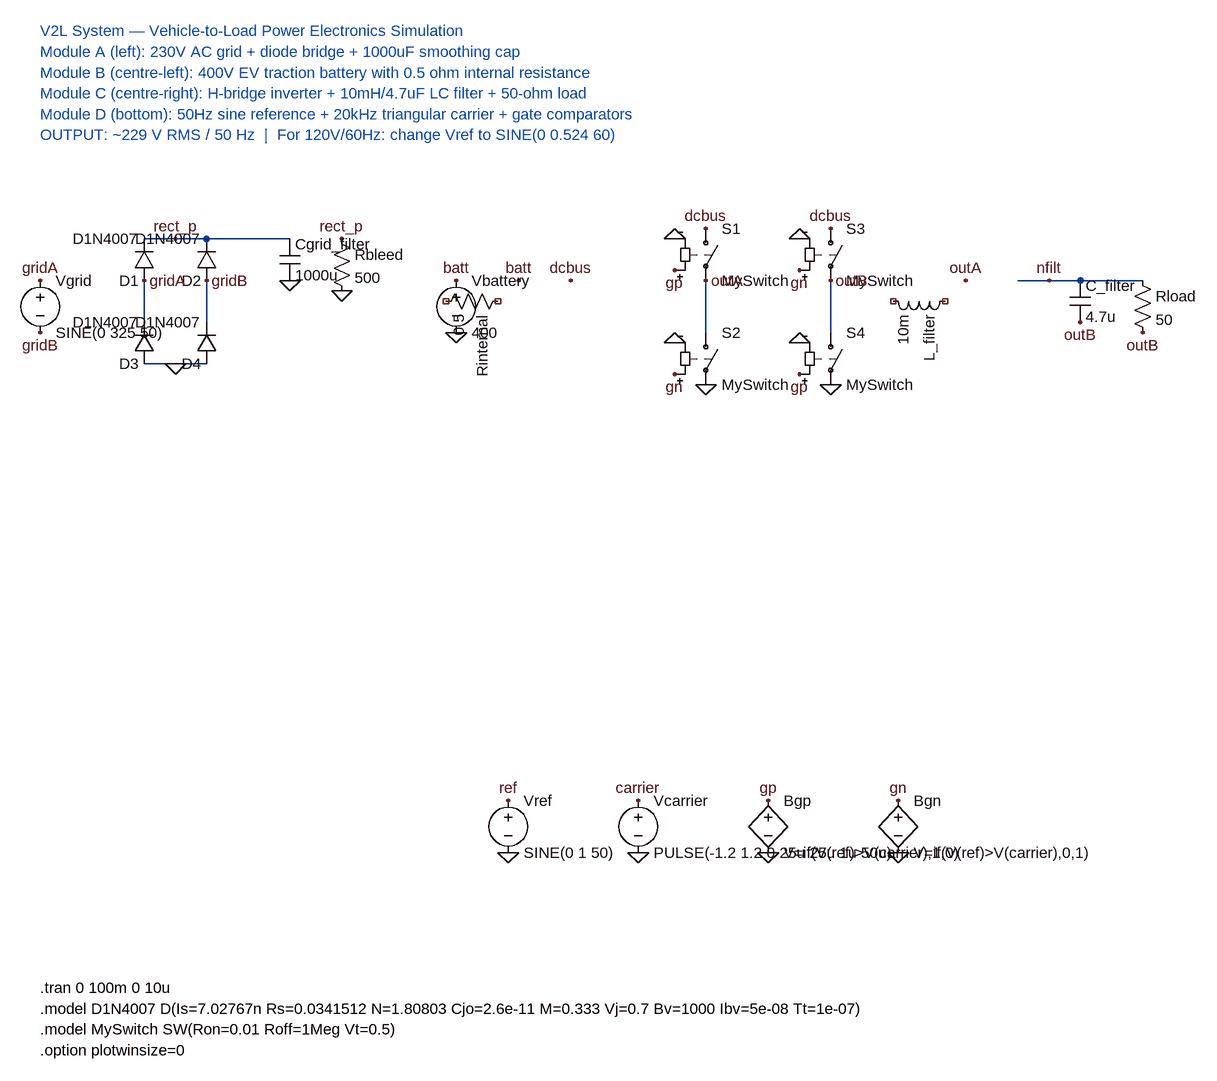
[diagram p0: schematic v2l.asc]
v2l.asc, the LTspice schematic file:
Version 4
SHEET 1 3600 2400
WIRE 240 368 336 368
WIRE 336 368 464 368
WIRE 240 560 336 560
WIRE 240 432 240 496
WIRE 336 432 336 496
WIRE 1104 432 1104 512
WIRE 1296 432 1296 512
WIRE 1584 432 1680 432
WIRE 1680 432 1776 432
FLAG 80 432 gridA
FLAG 80 512 gridB
FLAG 288 368 rect_p
FLAG 240 432 gridA
FLAG 336 432 gridB
FLAG 288 560 0
FLAG 464 432 0
FLAG 544 368 rect_p
FLAG 544 448 0
FLAG 720 432 batt
FLAG 720 512 0
FLAG 816 432 batt
FLAG 896 432 dcbus
FLAG 1104 352 dcbus
FLAG 1104 432 outA
FLAG 1056 416 gp
FLAG 1056 368 0
FLAG 1104 592 0
FLAG 1056 576 gn
FLAG 1056 528 0
FLAG 1296 352 dcbus
FLAG 1296 432 outB
FLAG 1248 416 gn
FLAG 1248 368 0
FLAG 1296 592 0
FLAG 1248 576 gp
FLAG 1248 528 0
FLAG 1504 432 outA
FLAG 1632 432 nfilt
FLAG 1680 496 outB
FLAG 1776 512 outB
FLAG 800 1232 ref
FLAG 800 1312 0
FLAG 1000 1232 carrier
FLAG 1000 1312 0
FLAG 1200 1232 gp
FLAG 1200 1312 0
FLAG 1400 1232 gn
FLAG 1400 1312 0
SYMBOL Voltage 80 416 R0
SYMATTR InstName Vgrid
SYMATTR Value SINE(0 325 50)
SYMBOL Diode 256 432 R180
SYMATTR InstName D1
SYMATTR Value D1N4007
SYMBOL Diode 352 432 R180
SYMATTR InstName D2
SYMATTR Value D1N4007
SYMBOL Diode 256 560 R180
SYMATTR InstName D3
SYMATTR Value D1N4007
SYMBOL Diode 352 560 R180
SYMATTR InstName D4
SYMATTR Value D1N4007
SYMBOL Cap 448 368 R0
SYMATTR InstName Cgrid_filter
SYMATTR Value 1000u
SYMBOL Res 528 352 R0
SYMATTR InstName Rbleed
SYMATTR Value 500
SYMBOL Voltage 720 416 R0
SYMATTR InstName Vbattery
SYMATTR Value 400
SYMBOL Res 800 448 R90
SYMATTR InstName Rinternal
SYMATTR Value 0.5
SYMBOL Sw 1104 336 R0
SYMATTR InstName S1
SYMATTR Value MySwitch
SYMBOL Sw 1104 496 R0
SYMATTR InstName S2
SYMATTR Value MySwitch
SYMBOL Sw 1296 336 R0
SYMATTR InstName S3
SYMATTR Value MySwitch
SYMBOL Sw 1296 496 R0
SYMATTR InstName S4
SYMATTR Value MySwitch
SYMBOL Ind 1488 448 R90
SYMATTR InstName L_filter
SYMATTR Value 10m
SYMBOL Cap 1664 432 R0
SYMATTR InstName C_filter
SYMATTR Value 4.7u
SYMBOL Res 1760 416 R0
SYMATTR InstName Rload
SYMATTR Value 50
SYMBOL Voltage 800 1216 R0
SYMATTR InstName Vref
SYMATTR Value SINE(0 1 50)
SYMBOL Voltage 1000 1216 R0
SYMATTR InstName Vcarrier
SYMATTR Value PULSE(-1.2 1.2 0 25u 25u 1u 50u)
SYMBOL Bv 1200 1216 R0
SYMATTR InstName Bgp
SYMATTR Value V=if(V(ref)>V(carrier),1,0)
SYMBOL Bv 1400 1216 R0
SYMATTR InstName Bgn
SYMATTR Value V=if(V(ref)>V(carrier),0,1)
TEXT 80 48 Left 2 ;V2L System — Vehicle-to-Load Power Electronics Simulation
TEXT 80 80 Left 2 ;Module A (left): 230V AC grid + diode bridge + 1000uF smoothing cap
TEXT 80 112 Left 2 ;Module B (centre-left): 400V EV traction battery with 0.5 ohm internal resistance
TEXT 80 144 Left 2 ;Module C (centre-right): H-bridge inverter + 10mH/4.7uF LC filter + 50-ohm load
TEXT 80 176 Left 2 ;Module D (bottom): 50Hz sine reference + 20kHz triangular carrier + gate comparators
TEXT 80 208 Left 2 ;OUTPUT: ~229 V RMS / 50 Hz  |  For 120V/60Hz: change Vref to SINE(0 0.524 60)
TEXT 80 1520 Left 2 !.tran 0 100m 0 10u
TEXT 80 1552 Left 2 !.model D1N4007 D(Is=7.02767n Rs=0.0341512 N=1.80803 Cjo=2.6e-11 M=0.333 Vj=0.7 Bv=1000 Ibv=5e-08 Tt=1e-07)
TEXT 80 1584 Left 2 !.model MySwitch SW(Ron=0.01 Roff=1Meg Vt=0.5)
TEXT 80 1616 Left 2 !.option plotwinsize=0

The netlist it stands for:
* v2l.asc
Vgrid gridA gridB SINE(0 325 50)
D1 gridA rect_p D1N4007
D2 gridB rect_p D1N4007
D3 0 gridA D1N4007
D4 0 gridB D1N4007
Cgrid_filter rect_p 0 1000u
Rbleed rect_p 0 500
Vbattery batt 0 400
Rinternal NC_01 NC_02 0.5
S1 dcbus outA gp 0 MySwitch
S2 outA 0 gn 0 MySwitch
S3 dcbus outB gn 0 MySwitch
S4 outB 0 gp 0 MySwitch
L_filter NC_03 NC_04 10m
C_filter nfilt outB 4.7u
Rload nfilt outB 50
Vref ref 0 SINE(0 1 50)
Vcarrier carrier 0 PULSE(-1.2 1.2 0 25u 25u 1u 50u)
Bgp gp 0 V=if(V(ref)>V(carrier),1,0)
Bgn gn 0 V=if(V(ref)>V(carrier),0,1)
.model D D
.lib standard.dio
* V2L System — Vehicle-to-Load Power Electronics Simulation
* Module A (left): 230V AC grid + diode bridge + 1000uF smoothing cap
* Module B (centre-left): 400V EV traction battery with 0.5 ohm internal resistance
* Module C (centre-right): H-bridge inverter + 10mH/4.7uF LC filter + 50-ohm load
* Module D (bottom): 50Hz sine reference + 20kHz triangular carrier + gate comparators
* OUTPUT: ~229 V RMS / 50 Hz  |  For 120V/60Hz: change Vref to SINE(0 0.524 60)
.tran 0 100m 0 10u
.model D1N4007 D(Is=7.02767n Rs=0.0341512 N=1.80803 Cjo=2.6e-11 M=0.333 Vj=0.7 Bv=1000 Ibv=5e-08 Tt=1e-07)
.model MySwitch SW(Ron=0.01 Roff=1Meg Vt=0.5)
.option plotwinsize=0
.backanno
.end